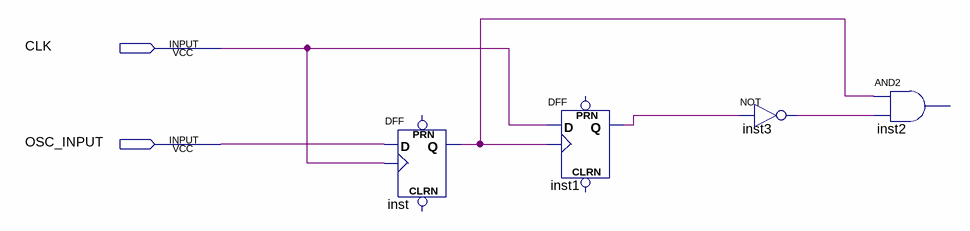
[diagram p0: schematic sheet]
// Quartus schematic Maquina_Estados.bdf as structural Verilog: 4 symbols, 2 pins
module Maquina_Estados (
  input  CLK,
  input  OSC_INPUT
);

  wire inst1_q, inst3_out, inst_q;

  DFF inst (.CLK(CLK), .D(OSC_INPUT), .Q(inst_q));  // open: CLRN, PRN
  DFF inst1 (.CLK(inst_q), .D(CLK), .Q(inst1_q));  // open: CLRN, PRN
  not inst3 (inst3_out, inst1_q);
  // AND2 inst2 has open pins: IN1=inst_q, IN2=inst3_out, OUT=open
endmodule
